# Altium schematic sheet STM_MCU.SchDoc
size A4
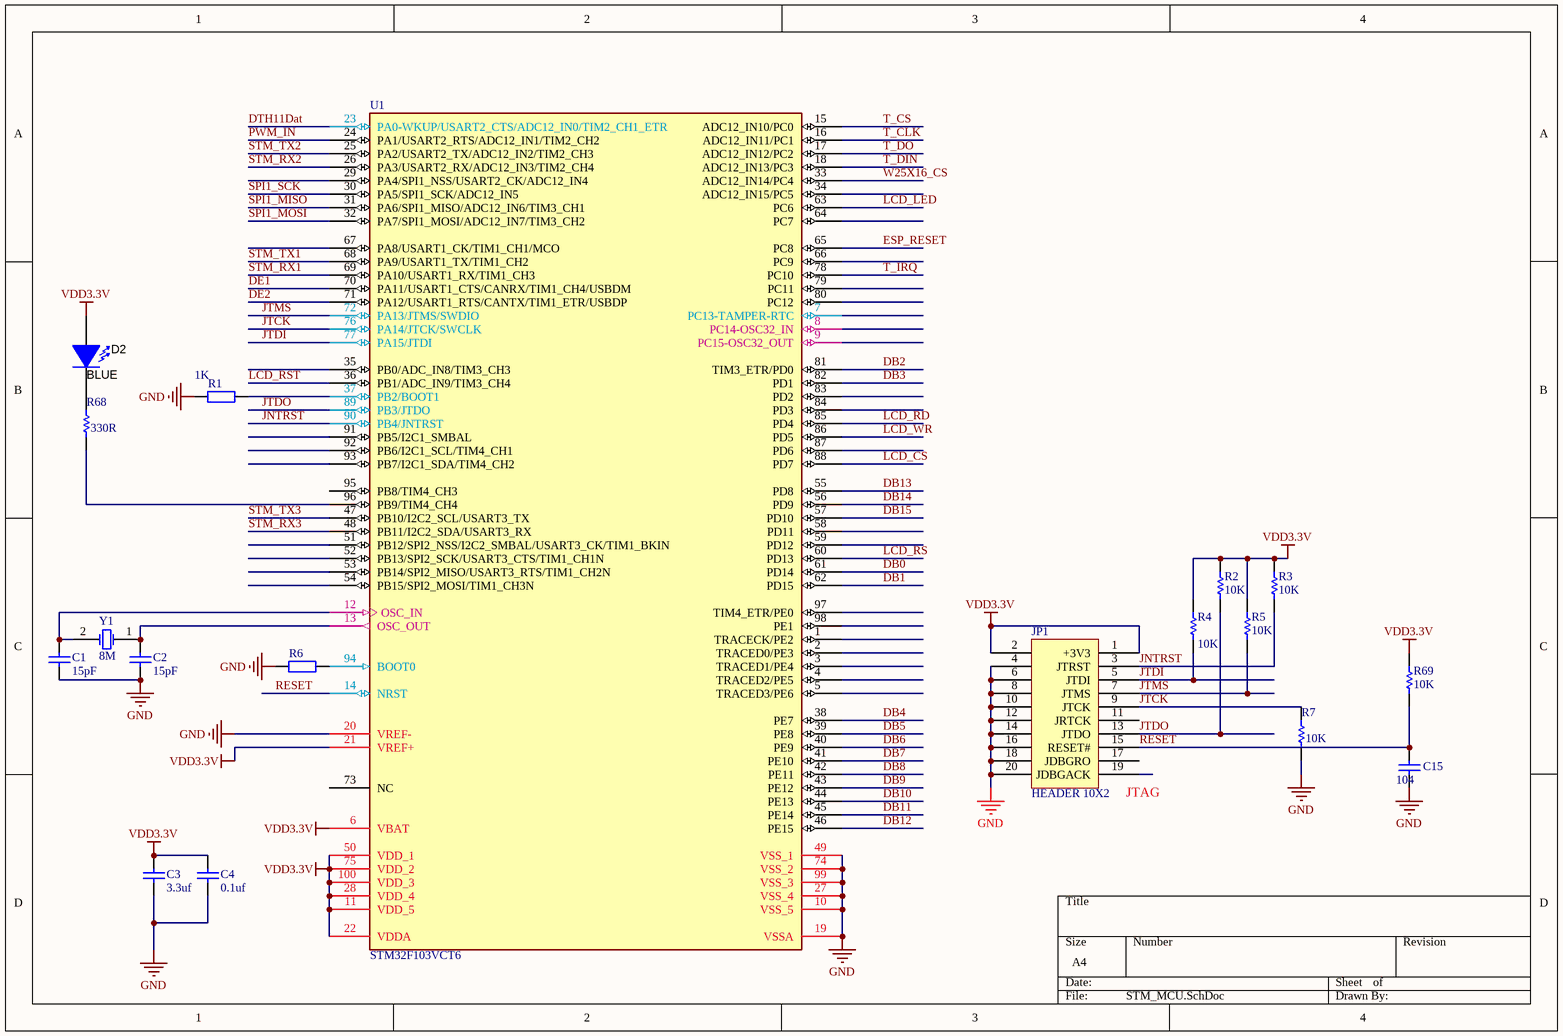
[diagram p0: STM_MCU.SchDoc]

## Parts
C1  value 15pF  [C0805]  (hidden comment: Cap)
C2  value 15pF  [C0805]  (hidden comment: Cap)
C3  value 3.3uf  [C0805]  (hidden comment: Cap)
C4  value 0.1uf  [C0805]  (hidden comment: Cap)
C15  104  [C0805]
D2  value BLUE  [D0805]  (hidden comment: SML-P12YTT86)
JP1  HEADER 10X2  [STM32-JLINK]
R1  value 1K  [0805]  (hidden comment: Res2)
R2  value 10K  [0805]  (hidden comment: Res Semi)
R3  value 10K  [0805]  (hidden comment: Res Semi)
R4  value 10K  [0805]  (hidden comment: Res Semi)
R5  value 10K  [0805]  (hidden comment: Res Semi)
R6  Res2  [0805]  (value not drawn)
R7  value 10K  [0805]  (hidden comment: Res Semi)
R68  value 330R  [0805]  (hidden comment: Res Semi)
R69  10K  [0805]
U1  STM32F103VCT6  [LQFP100_M]
Y1  XTAL  [CY]  (value not drawn)

## Nets
GND: C1.1 C2.1 C3.2 C4.2 C15.1 JP1.4 JP1.6 JP1.8 JP1.10 JP1.12 JP1.14 JP1.16 JP1.18 JP1.20 R1.1 R6.1 R7.1 U1.10(VSS_5) U1.19(VSSA) U1.20(VREF-) U1.27(VSS_4) U1.49(VSS_1) U1.74(VSS_2) U1.99(VSS_3)
VDD3.3V: C3.1 C4.1 D2.1(A) JP1.1(+3V3) JP1.2 R2.2 R3.2 R4.2 R5.2 R69.2 U1.6(VBAT) U1.11(VDD_5) U1.21(VREF+) U1.22(VDDA) U1.28(VDD_4) U1.50(VDD_1) U1.75(VDD_2) U1.100(VDD_3)
DB0: U1.61(PD14)
DB1: U1.62(PD15)
DB2: U1.81(TIM3_ETR/PD0)
DB3: U1.82(PD1)
DB4: U1.38(PE7)
DB5: U1.39(PE8)
DB6: U1.40(PE9)
DB7: U1.41(PE10)
DB8: U1.42(PE11)
DB9: U1.43(PE12)
DB10: U1.44(PE13)
DB11: U1.45(PE14)
DB12: U1.46(PE15)
DB13: U1.55(PD8)
DB14: U1.56(PD9)
DB15: U1.57(PD10)
DE1: U1.70(PA11/USART1_CTS/CANRX/TIM1_CH4/USBDM)
DE2: U1.71(PA12/USART1_RTS/CANTX/TIM1_ETR/USBDP)
DTH11Dat: U1.23(PA0-WKUP/USART2_CTS/ADC12_IN0/TIM2_CH1_ETR)
ESP_RESET: U1.65(PC8)
JNTRST: JP1.3(JTRST) R3.1 U1.90(PB4/JNTRST)
JTCK: JP1.9(JTCK) R7.2 U1.76(PA14/JTCK/SWCLK)
JTDI: JP1.5(JTDI) R4.1 U1.77(PA15/JTDI)
JTDO: JP1.13(JTDO) R2.1 U1.89(PB3/JTDO)
JTMS: JP1.7(JTMS) R5.1 U1.72(PA13/JTMS/SWDIO)
LCD_CS: U1.88(PD7)
LCD_LED: U1.63(PC6)
LCD_RD: U1.85(PD4)
LCD_RS: U1.60(PD13)
LCD_RST: U1.36(PB1/ADC_IN9/TIM3_CH4)
LCD_WR: U1.86(PD5)
PWM_IN: U1.24(PA1/USART2_RTS/ADC12_IN1/TIM2_CH2)
RESET: C15.2 JP1.15(RESET#) R69.1 U1.14(NRST)
SPI1_MISO: U1.31(PA6/SPI1_MISO/ADC12_IN6/TIM3_CH1)
SPI1_MOSI: U1.32(PA7/SPI1_MOSI/ADC12_IN7/TIM3_CH2)
SPI1_SCK: U1.30(PA5/SPI1_SCK/ADC12_IN5)
STM_RX1: U1.69(PA10/USART1_RX/TIM1_CH3)
STM_RX2: U1.26(PA3/USART2_RX/ADC12_IN3/TIM2_CH4)
STM_RX3: U1.48(PB11/I2C2_SDA/USART3_RX)
STM_TX1: U1.68(PA9/USART1_TX/TIM1_CH2)
STM_TX2: U1.25(PA2/USART2_TX/ADC12_IN2/TIM2_CH3)
STM_TX3: U1.47(PB10/I2C2_SCL/USART3_TX)
T_CLK: U1.16(ADC12_IN11/PC1)
T_CS: U1.15(ADC12_IN10/PC0)
T_DIN: U1.18(ADC12_IN13/PC3)
T_DO: U1.17(ADC12_IN12/PC2)
T_IRQ: U1.78(PC10)
W25X16_CS: U1.33(ADC12_IN14/PC4)
NetC1_2: C1.2 U1.12(OSC_IN) Y1.2(OSC2)
NetC2_2: C2.2 U1.13(OSC_OUT) Y1.1(OSC1)
NetD2_2: D2.2(K) R68.2
NetR1_2: R1.2 U1.37(PB2/BOOT1)
NetR6_2: R6.2 U1.94(BOOT0)
NetR68_1: R68.1 U1.96(PB9/TIM4_CH4)

Not connected (* = marked no-connect by the designer): JP1 11(JRTCK) 17(JDBGRO) 19(JDBGACK); U1 1(TRACECK/PE2) 2(TRACED0/PE3) 3(TRACED1/PE4) 4(TRACED2/PE5) 5(TRACED3/PE6) 7(PC13-TAMPER-RTC) 8(PC14-OSC32_IN) 9(PC15-OSC32_OUT) 29(PA4/SPI1_NSS/USART2_CK/ADC12_IN4) 34(ADC12_IN15/PC5) 35(PB0/ADC_IN8/TIM3_CH3) 51(PB12/SPI2_NSS/I2C2_SMBAL/USART3_CK/TIM1_BKIN) 52(PB13/SPI2_SCK/USART3_CTS/TIM1_CH1N) 53(PB14/SPI2_MISO/USART3_RTS/TIM1_CH2N) 54(PB15/SPI2_MOSI/TIM1_CH3N) 58(PD11) 59(PD12) 64(PC7) 66(PC9) 67(PA8/USART1_CK/TIM1_CH1/MCO) 73(NC) 79(PC11) 80(PC12) 83(PD2) 84(PD3) 87(PD6) 91(PB5/I2C1_SMBAL) 92(PB6/I2C1_SCL/TIM4_CH1) 93(PB7/I2C1_SDA/TIM4_CH2) 95(PB8/TIM4_CH3) 97(TIM4_ETR/PE0) 98(PE1)

## Notes on the sheet
- (near JP1) JTAG
- (in symbol XTAL) 8M

## Library data of the parts
C1 C2 = Cap: Capacitor; Published: 8-Jun-2000; LatestRevisionDate: 17-Jul-2002; LatestRevisionNote: Re-released for DXP Platform.; PackageReference: RAD-0.3; Publisher: Altium Limited
C3 C4 = Cap: Capacitor; Manufacturer: Generic Components; Class: Passive; Published: 08/06/2000; Publisher: Altium Hobart Technology Centre; SubClass: Capacitor
C15 = Cap_2: Capacitor; Published: 8-Jun-2000; LatestRevisionDate: 17-Jul-2002; LatestRevisionNote: Re-released for DXP Platform.; Publisher: Altium Limited
D2 = SML-P12YTT86: LED, GREEN SMD; Manufacturer: Rohm; Type: InGaN; Vf_V: 2.1; Value2: 2.1V; Io_A: 0.02; Tjmax_C: 85; Value1: W; Color: yellow; U/M: EA; CompType: LED; PartNumber: SML-P12YTT86; SymbolVersion: 2008-12-08; MountType: SMT; RoHS: Y; PackageReference: Yellow LED; Published: 2008-07-11; Publisher: Texas Instruments; ComponentLink1URL: http://rohmfs.rohm.com/en/products/databook/datasheet/opto/led/chip_mono/sml-p1.pdf; ComponentLink1Description: Datasheet link; LatestRevisionDate: 2013-06-24; LatestRevisionNote: Updated supplier queries; Supplier 1: Digi-Key; Supplier Part Number 1: 511-1595-1-ND; Supplier 2: Mouser; Supplier Part Number 2: 755-SML-P12YTT86; Supplier 3: Farnell; Supplier Part Number 3: 1973107
R1 = RES
R2-R5 R7 R68 R69 = Res Semi: Semiconductor Resistor; Published: 8-Jun-2000; LatestRevisionDate: 17-Jul-2002; LatestRevisionNote: Re-released for DXP Platform.; PackageReference: AXIAL-0.5; Publisher: Altium Limited
  R69: Value: 10K
R6 = RES: Value: 10K
U1 = STM32F103VBT6: STM32 ARM-based 32-bit MCU with 64 Kbytes Flash, 100-pin LQFP, Industrial Temperature; Published: *; DatasheetVersion: *; PackageVersion: *; PackageReference: *; Publisher: *; PackageDescription: *; ComponentLink1Description: *; ComponentLink1URL: *; ComponentLink2Description: *; ComponentLink2URL: *
Y1 = XTAL: Crystal Oscillator; Published: 8-Jun-2000; LatestRevisionDate: 17-Jul-2002; LatestRevisionNote: Re-released for DXP Platform.; PackageReference: R38; Publisher: Altium Limited